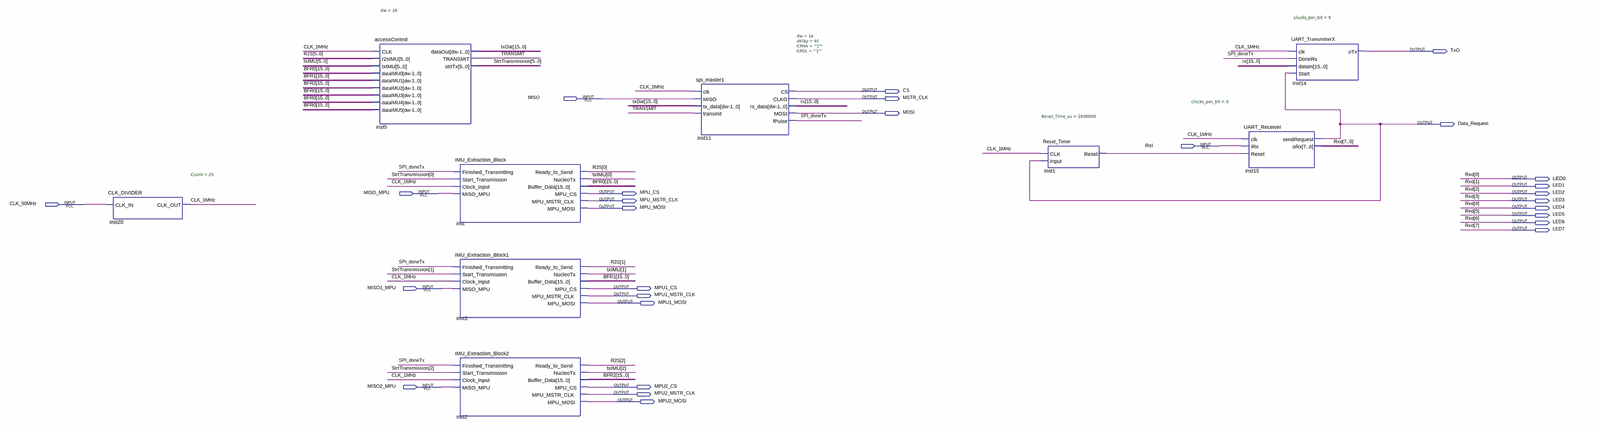
[diagram p0: schematic sheet, whole]
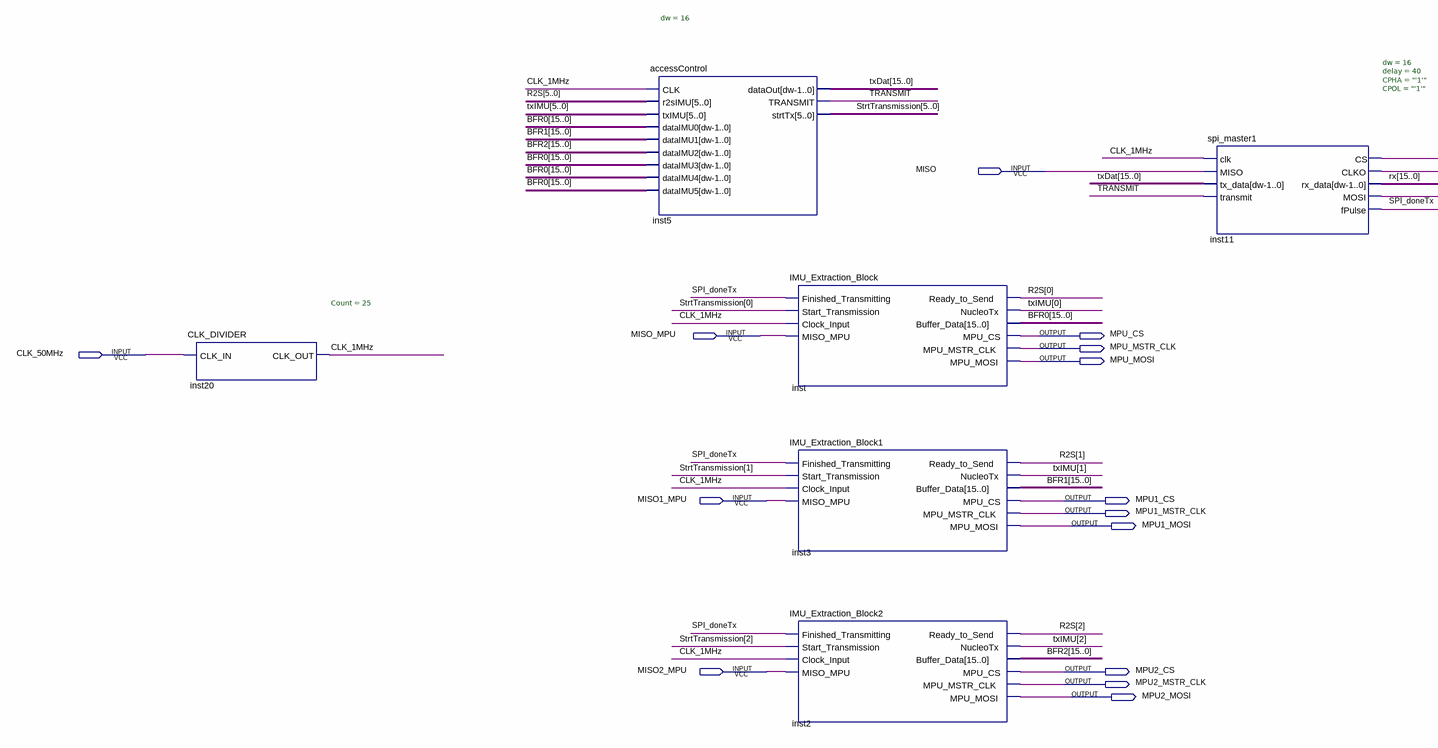
[diagram p1: schematic sheet, left part]
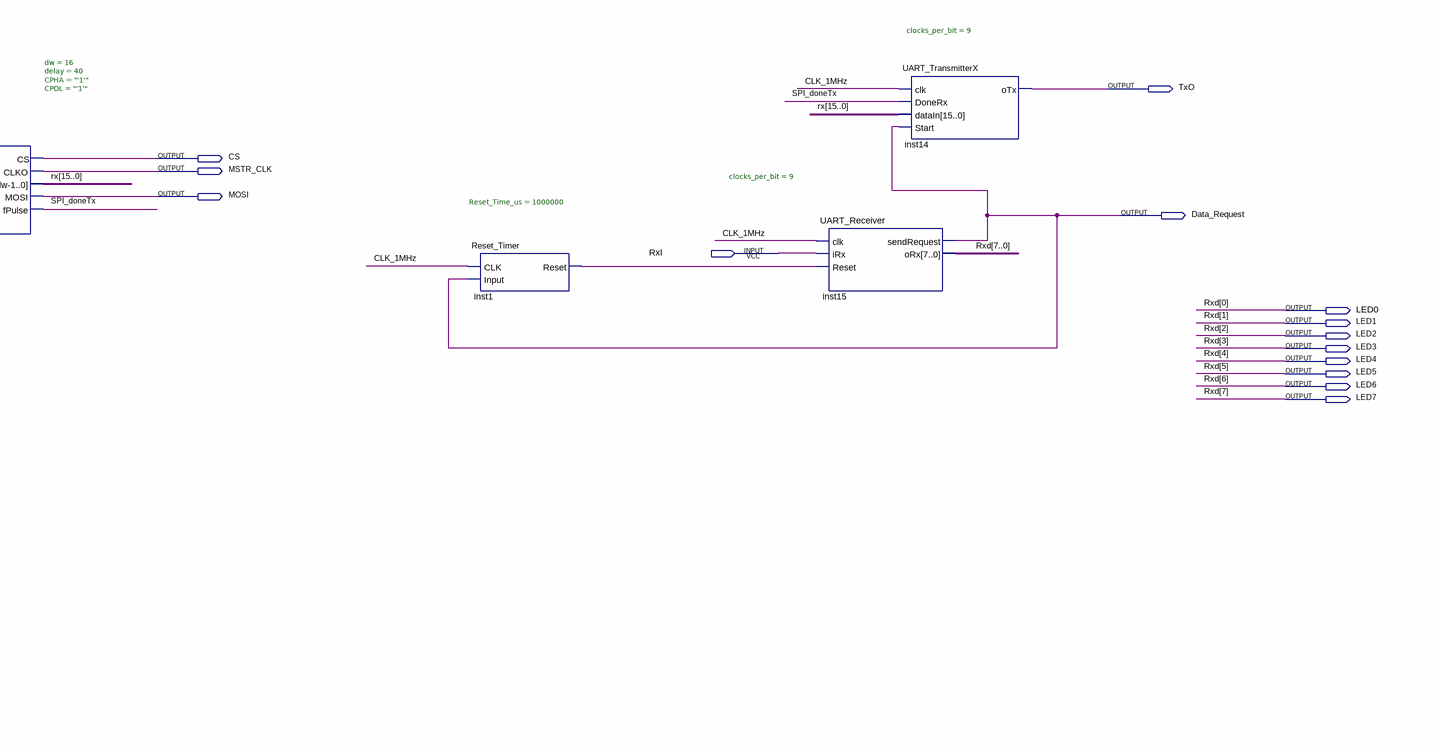
[diagram p2: schematic sheet, right part]
// Quartus schematic Data_Extraction_System.bdf as structural Verilog: 9 symbols, 28 pins
module Data_Extraction_System (
  input  MISO,
  input  RxI,
  input  MISO_MPU,
  input  CLK_50MHz,
  input  MISO1_MPU,
  input  MISO2_MPU,
  output TxO,
  output CS,
  output MSTR_CLK,
  output MOSI,
  output Data_Request,
  output LED0,
  output LED1,
  output MPU_CS,
  output LED2,
  output MPU_MSTR_CLK,
  output LED3,
  output MPU_MOSI,
  output LED4,
  output LED5,
  output LED6,
  output LED7,
  output MPU1_CS,
  output MPU1_MSTR_CLK,
  output MPU1_MOSI,
  output MPU2_CS,
  output MPU2_MSTR_CLK,
  output MPU2_MOSI
);

  wire CLK_1MHz, inst1_reset, SPI_doneTx, TRANSMIT;
  wire [5:0] R2S, StrtTransmission, txIMU;
  wire [15:0] BFR0, BFR1, BFR2, rx, txDat;

  CLK_DIVIDER #(.Count(25)) inst20 (.CLK_IN(CLK_50MHz), .CLK_OUT(CLK_1MHz));
  accessControl #(.dw(16)) inst5 (
    .CLK(CLK_1MHz), .r2sIMU(R2S), .txIMU(txIMU), .dataIMU0(BFR0), .dataIMU1(BFR1), .dataIMU2(BFR2),
    .dataIMU3(BFR0), .dataIMU4(BFR0), .dataIMU5(BFR0), .dataOut(txDat), .TRANSMIT(TRANSMIT),
    .strtTx(StrtTransmission));
  IMU_Extraction_Block inst (
    .Finished_Transmitting(SPI_doneTx), .Start_Transmission(StrtTransmission[0]), .Clock_Input(CLK_1MHz),
    .MISO_MPU(MISO_MPU), .Ready_to_Send(R2S[0]), .NucleoTx(txIMU[0]), .Buffer_Data(BFR0), .MPU_CS(MPU_CS),
    .MPU_MSTR_CLK(MPU_MSTR_CLK), .MPU_MOSI(MPU_MOSI));
  IMU_Extraction_Block1 inst3 (
    .Finished_Transmitting(SPI_doneTx), .Start_Transmission(StrtTransmission[1]), .Clock_Input(CLK_1MHz),
    .MISO_MPU(MISO1_MPU), .Ready_to_Send(R2S[1]), .NucleoTx(txIMU[1]), .Buffer_Data(BFR1), .MPU_CS(MPU1_CS),
    .MPU_MSTR_CLK(MPU1_MSTR_CLK), .MPU_MOSI(MPU1_MOSI));
  IMU_Extraction_Block2 inst2 (
    .Finished_Transmitting(SPI_doneTx), .Start_Transmission(StrtTransmission[2]), .Clock_Input(CLK_1MHz),
    .MISO_MPU(MISO2_MPU), .Ready_to_Send(R2S[2]), .NucleoTx(txIMU[2]), .Buffer_Data(BFR2), .MPU_CS(MPU2_CS),
    .MPU_MSTR_CLK(MPU2_MSTR_CLK), .MPU_MOSI(MPU2_MOSI));
  spi_master1 #(.dw(16), .delay(40), .CPHA("'1'"), .CPOL("'1'")) inst11 (
    .clk(CLK_1MHz), .MISO(MISO), .tx_data(txDat), .transmit(TRANSMIT), .CS(CS), .CLKO(MSTR_CLK),
    .rx_data(rx), .MOSI(MOSI), .fPulse(SPI_doneTx));
  Reset_Timer #(.Reset_Time_us(1000000)) inst1 (.CLK(CLK_1MHz), .Input(Data_Request), .Reset(inst1_reset));
  UART_Receiver #(.clocks_per_bit(9)) inst15 (
    .clk(CLK_1MHz), .iRx(RxI), .Reset(inst1_reset), .sendRequest(Data_Request),
    .oRx({LED7, LED6, LED5, LED4, LED3, LED2, LED1, LED0}));
  UART_TransmitterX #(.clocks_per_bit(9)) inst14 (
    .clk(CLK_1MHz), .DoneRx(SPI_doneTx), .dataIn(rx), .Start(Data_Request), .oTx(TxO));

  // Other names for the same wires on the sheet: Rxd[7:0] = {LED7, LED6, LED5, LED4, LED3, LED2, LED1, LED0}
endmodule
